# EAGLE design DSP_CNC (EAGLE 9.0.0)
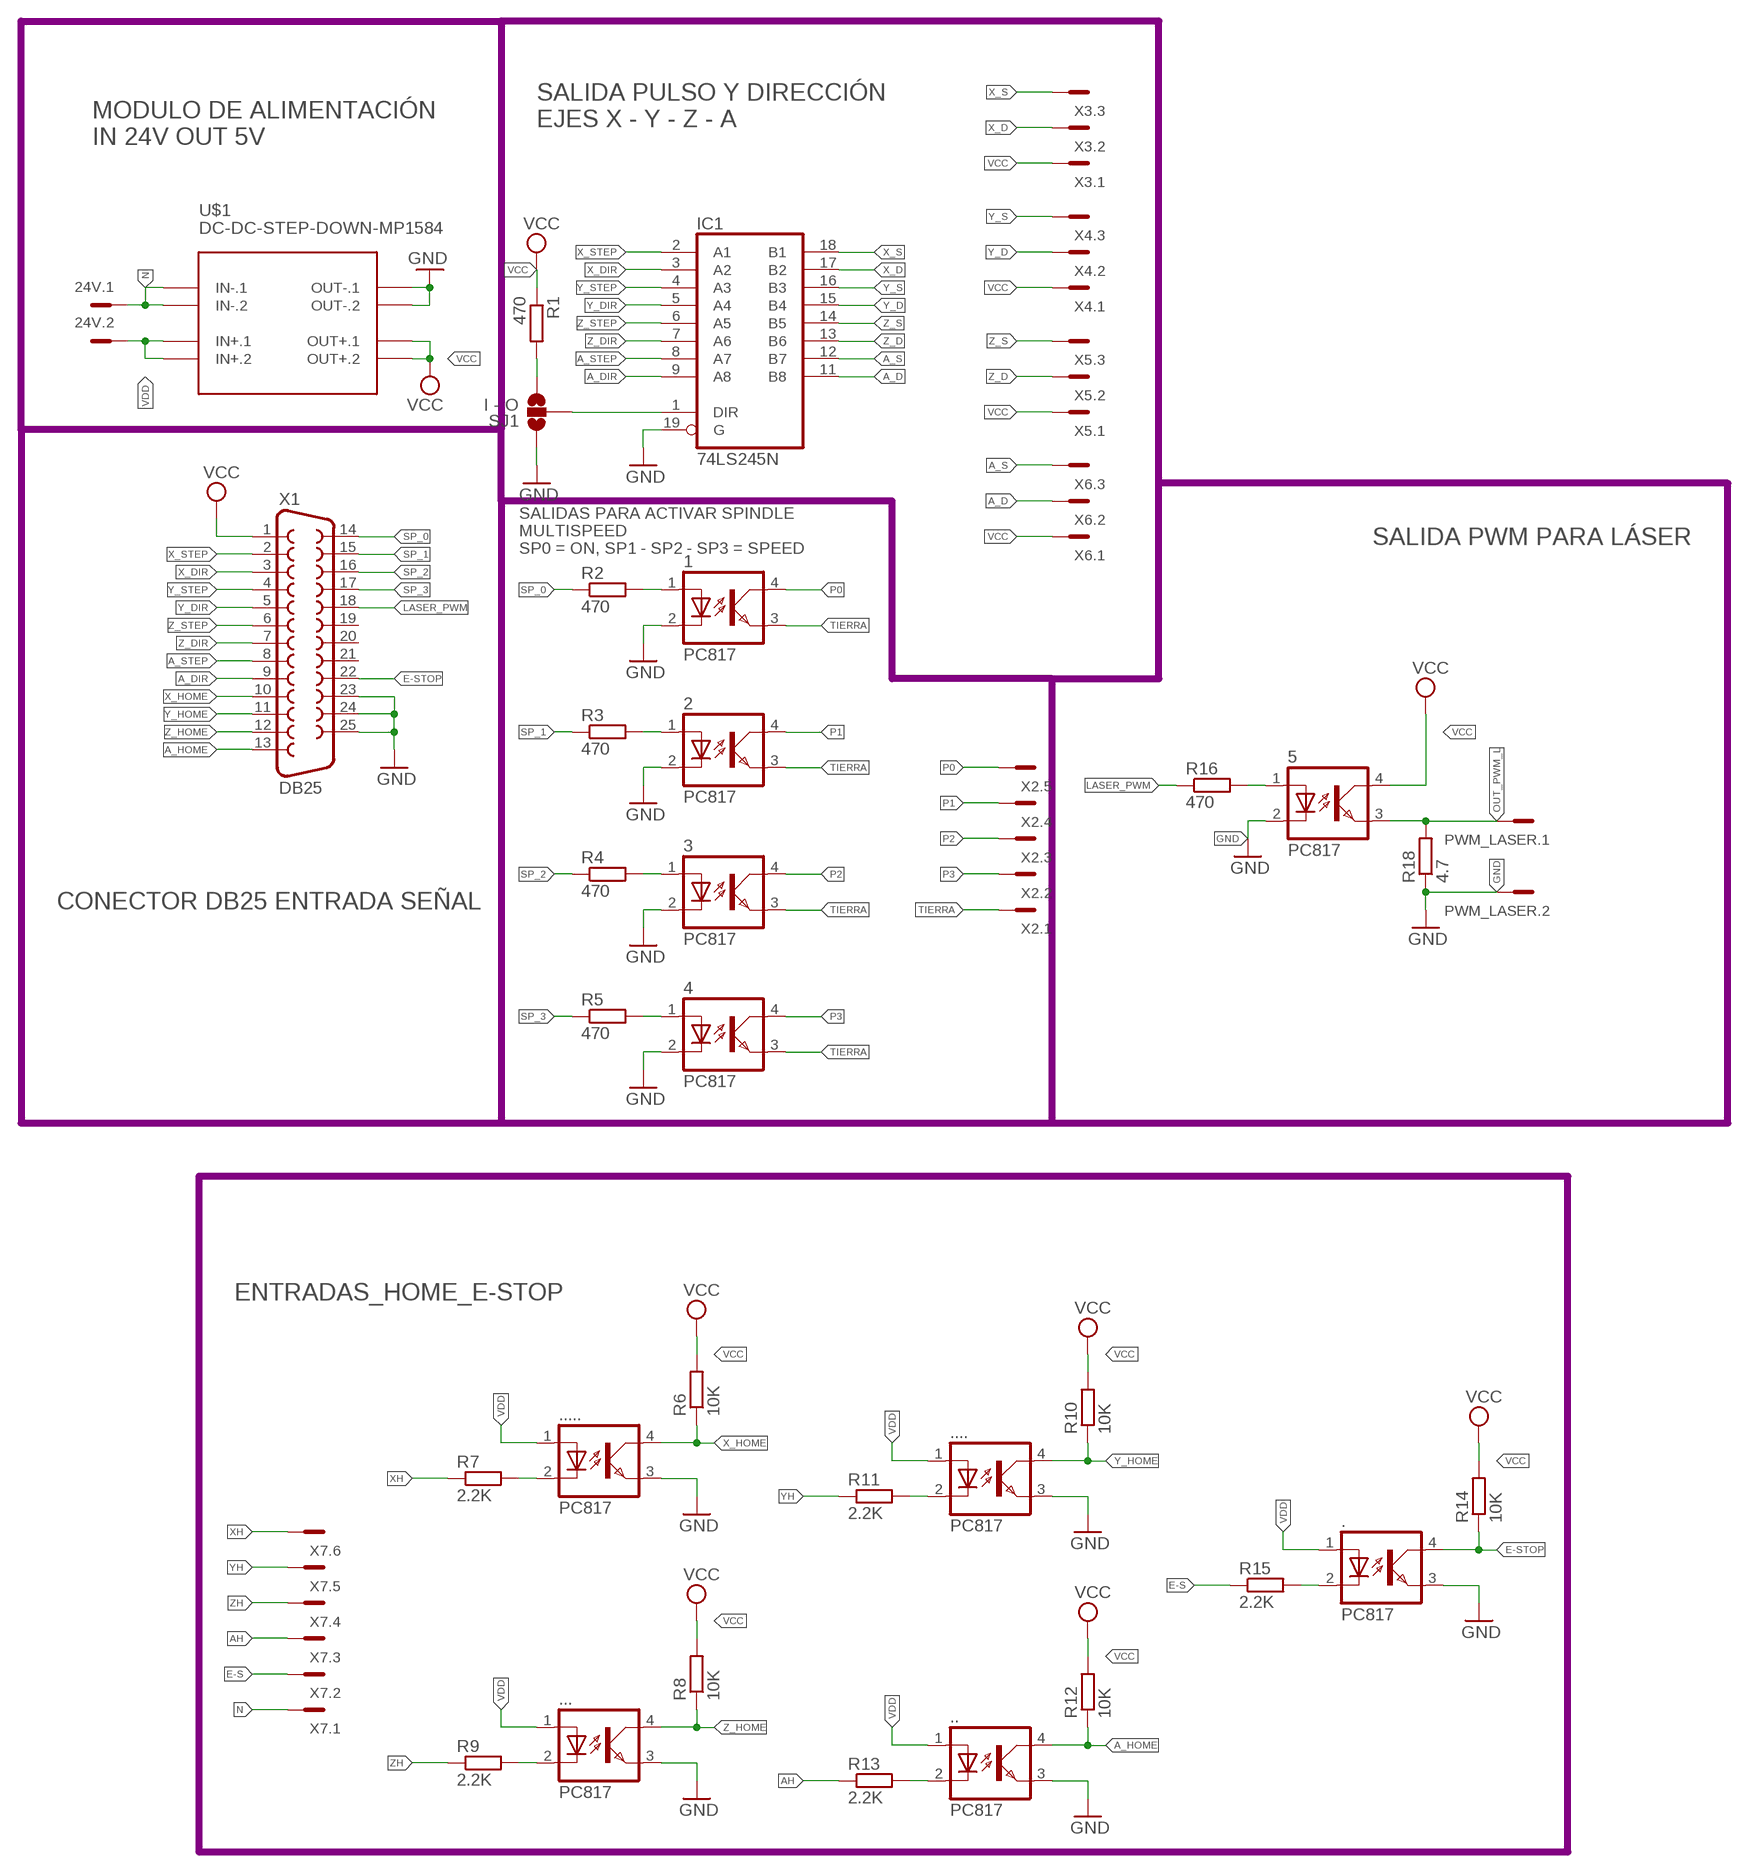
[diagram p0: schematic, sheet 1]

## Parts
1  PC817  [DIL04]
2  PC817  [DIL04]
3  PC817  [DIL04]
4  PC817  [DIL04]
5  PC817  [DIL04]
24V  MCV2  [MCV2]
.  PC817  [DIL04]
..  PC817  [DIL04]
...  PC817  [DIL04]
....  PC817  [DIL04]
.....  PC817  [DIL04]
IC1  74LS245N  [DIL20]
PWM_LASER  MCV2  [MCV2]
R1  470  R-EU_0207/10  [0207/10]
R2  470  R-EU_0207/10  [0207/10]
R3  470  R-EU_0207/10  [0207/10]
R4  470  R-EU_0207/10  [0207/10]
R5  470  R-EU_0207/10  [0207/10]
R6  10K  R-EU_0207/10  [0207/10]
R7  2.2K  R-EU_0207/10  [0207/10]
R8  10K  R-EU_0207/10  [0207/10]
R9  2.2K  R-EU_0207/10  [0207/10]
R10  10K  R-EU_0207/10  [0207/10]
R11  2.2K  R-EU_0207/10  [0207/10]
R12  10K  R-EU_0207/10  [0207/10]
R13  2.2K  R-EU_0207/10  [0207/10]
R14  10K  R-EU_0207/10  [0207/10]
R15  2.2K  R-EU_0207/10  [0207/10]
R16  470  R-EU_0207/10  [0207/10]
R18  4.7  R-EU_0207/10  [0207/10]
SJ1  I - O  SOLDERJUMPER_2WAY-OLDW  [SJ_2W]
U$1  DC-DC-STEP-DOWN-MP1584  [DC-DC-STEP-DOWN-MP1584]
X1  DB25  F25HP  [F25HP]
X2  SPINDLE ON - SP123  MCV5  [MCV5]
X3  EJE_X  MCV3  [MCV3]
X4  EJE_Y  MCV3  [MCV3]
X5  EJE_Z  MCV3  [MCV3]
X6  EJE_A  MCV3  [MCV3]
X7  INPUT_HOME_E-STOP  MCV6  [MCV6]

## Nets
A_D: IC1.11(B8) X6.2
A_DIR: IC1.9(A8) X1.9
A_HOME: ...4(COL) R12.1 X1.13
A_S: IC1.12(B7) X6.3
A_STEP: IC1.8(A7) X1.8
AH: R13.1 X7.3
E-S: R15.1 X7.2
E-STOP: ..4(COL) R14.1 X1.22
GND: 1.2(C) 2.2(C) 3.2(C) 4.2(C) 5.2(C) ..3(EMIT) ...3(EMIT) ....3(EMIT) .....3(EMIT) ......3(EMIT) IC1.19(G) PWM_LASER.2 R18.1 SJ1.1 U$1.OUT-.1 U$1.OUT-.2 X1.23 X1.24 X1.25
LASER_PWM: R16.1 X1.18
N: 24V.1 U$1.IN-.1 U$1.IN-.2 X7.1
N$1: 5.1(A) R16.2
N$3: R1.2 SJ1.3
N$4: IC1.1(DIR) SJ1.2
N$5: 2.1(A) R3.2
N$6: 1.1(A) R2.2
N$7: 3.1(A) R4.2
N$8: 4.1(A) R5.2
N$9: ......2(C) R7.2
N$10: ....2(C) R9.2
N$11: .....2(C) R11.2
N$12: ...2(C) R13.2
N$13: ..2(C) R15.2
OUT_PWM_L: 5.3(EMIT) PWM_LASER.1 R18.2
P0: 1.4(COL) X2.5
P1: 2.4(COL) X2.4
P2: 3.4(COL) X2.3
P3: 4.4(COL) X2.2
SP_0: R2.1 X1.14
SP_1: R3.1 X1.15
SP_2: R4.1 X1.16
SP_3: R5.1 X1.17
TIERRA: 1.3(EMIT) 2.3(EMIT) 3.3(EMIT) 4.3(EMIT) X2.1
VCC: 5.4(COL) R1.1 R6.2 R8.2 R10.2 R12.2 R14.2 U$1.OUT+.1 U$1.OUT+.2 X1.1 X3.1 X4.1 X5.1 X6.1
VDD: 24V.2 ..1(A) ...1(A) ....1(A) .....1(A) ......1(A) U$1.IN+.1 U$1.IN+.2
X_D: IC1.17(B2) X3.2
X_DIR: IC1.3(A2) X1.3
X_HOME: ......4(COL) R6.1 X1.10
X_S: IC1.18(B1) X3.3
X_STEP: IC1.2(A1) X1.2
XH: R7.1 X7.6
Y_D: IC1.15(B4) X4.2
Y_DIR: IC1.5(A4) X1.5
Y_HOME: .....4(COL) R10.1 X1.11
Y_S: IC1.16(B3) X4.3
Y_STEP: IC1.4(A3) X1.4
YH: R11.1 X7.5
Z_D: IC1.13(B6) X5.2
Z_DIR: IC1.7(A6) X1.7
Z_HOME: ....4(COL) R8.1 X1.12
Z_S: IC1.14(B5) X5.3
Z_STEP: IC1.6(A5) X1.6
ZH: R9.1 X7.4
Unconnected: X1.19 X1.20 X1.21

## Notes on the sheet
- SALIDA PULSO Y DIRECCIÓN
  EJES X - Y - Z - A
- MODULO DE ALIMENTACIÓN
  IN 24V OUT 5V
- SALIDAS PARA ACTIVAR SPINDLE
  MULTISPEED 
  SP0 = ON, SP1 - SP2 - SP3 = SPEED
- SALIDA PWM PARA LÁSER
- CONECTOR DB25 ENTRADA SEÑAL
- ENTRADAS_HOME_E-STOP

## Power pins joined to a net without a drawn wire
GND: IC1.10(GND)
VCC: IC1.20(VCC)

## Library data of the parts
1-5 . .. ... .... ..... = stepper_drivers_etc:PC817*: SHARP OPTO COUPLER
24V PWM_LASER = con-phoenix_3.81_mcv:MCV2: Mini-Combicon 3.81mm vertikal 2polig (ohne Gegenstecker)
IC1 = 74xx-us:74*245: Octal BUS TRANSCEIVER, 3-state
R1-R16 R18 = resistor:R-EU_: RESISTOR, European symbol
SJ1 = SparkFun:SOLDERJUMPER_2WAY-OLD: Solder Jumper 2 way solder jumper
U$1 = diy-modules:DC-DC-STEP-DOWN-MP1584: DC/DC Step-Down Regulator based on MP1584 chip MP1584 datasheet available here: http://www.haoyuelectronics.com/Attachment/MP1584/MP1584.pdf Click here to find device on ebay.com <http://www.ebay.com/sch/mp1584+module>
X1 = SparkFun:F25: D-SUB 25 25 Pin male connector. PCB edge mount for regular PCB thicknesses. This connector will connect directly to the back of a PC parallel port or through a normal DB25 extension cable (M/F). SKU: PRT-08287
X2 = con-phoenix_3.81_mcv:MCV5: Mini-Combicon 3.81mm vertikal 5polig (ohne Gegenstecker)
X3-X6 = con-phoenix_3.81_mcv:MCV3: Mini-Combicon 3.81mm vertikal 3polig (ohne Gegenstecker)
X7 = con-phoenix_3.81_mcv:MCV6: Mini-Combicon 3.81mm vertikal 6polig (ohne Gegenstecker)

## Board
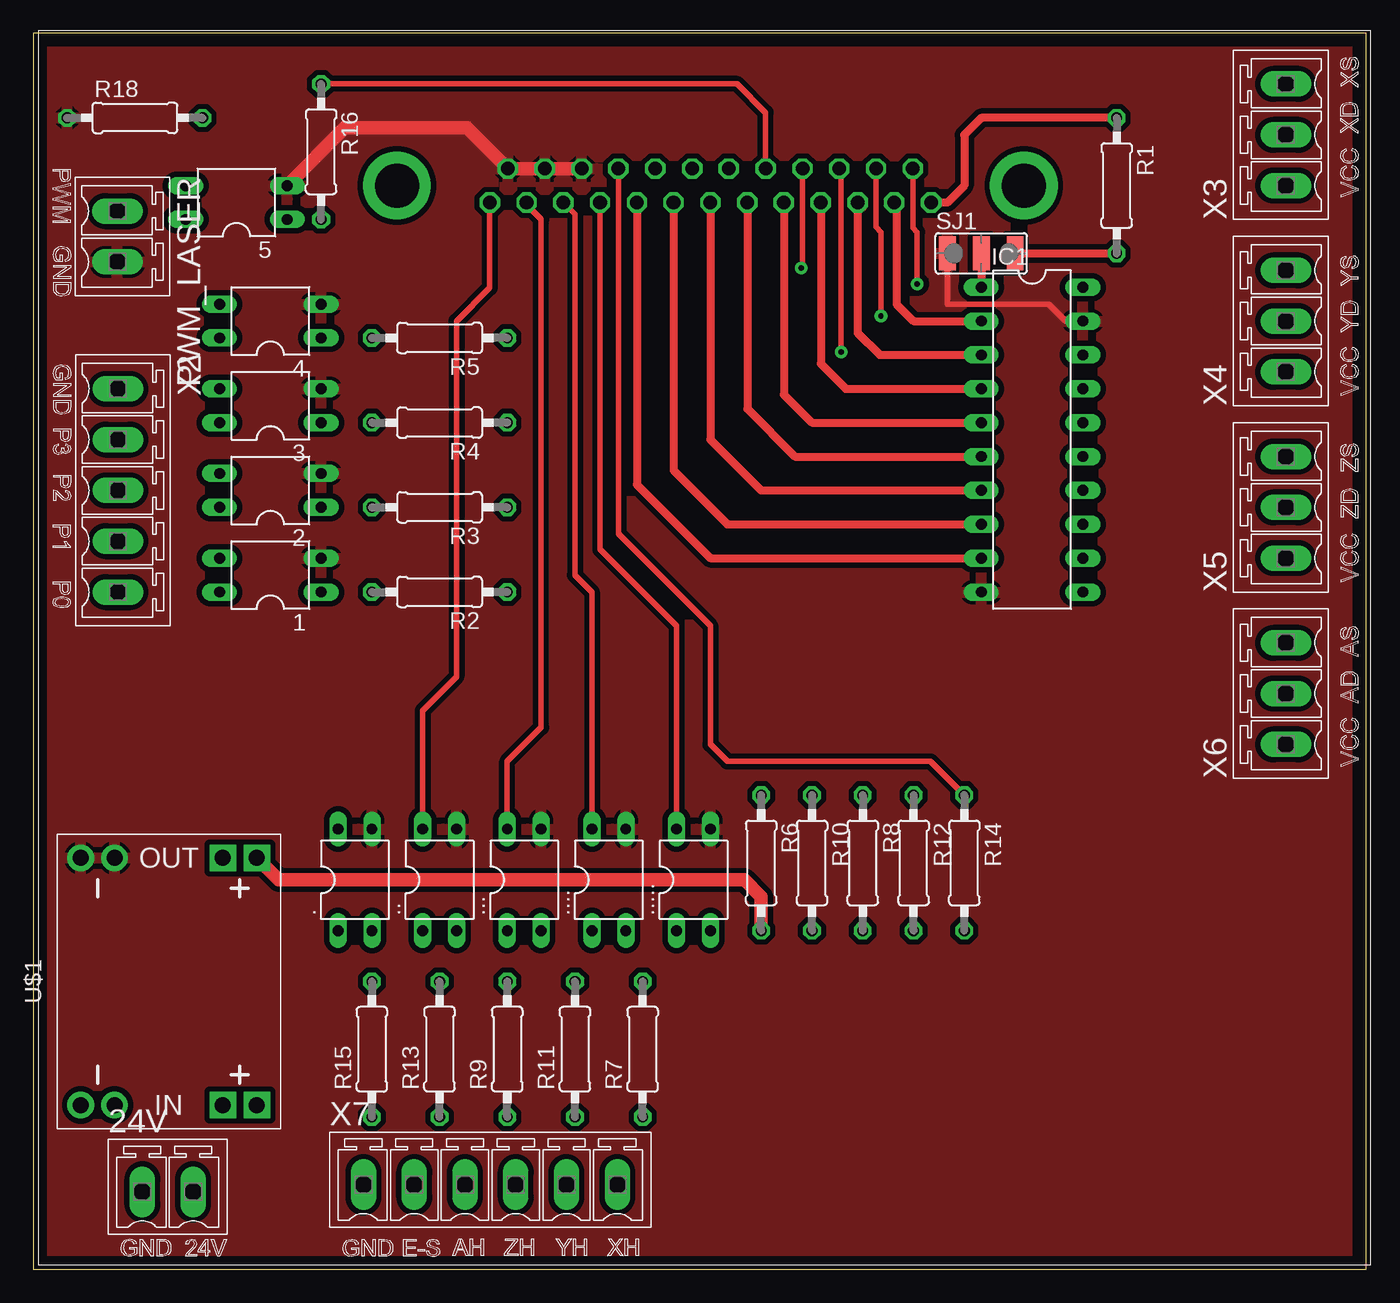
[diagram p1: board, top side]
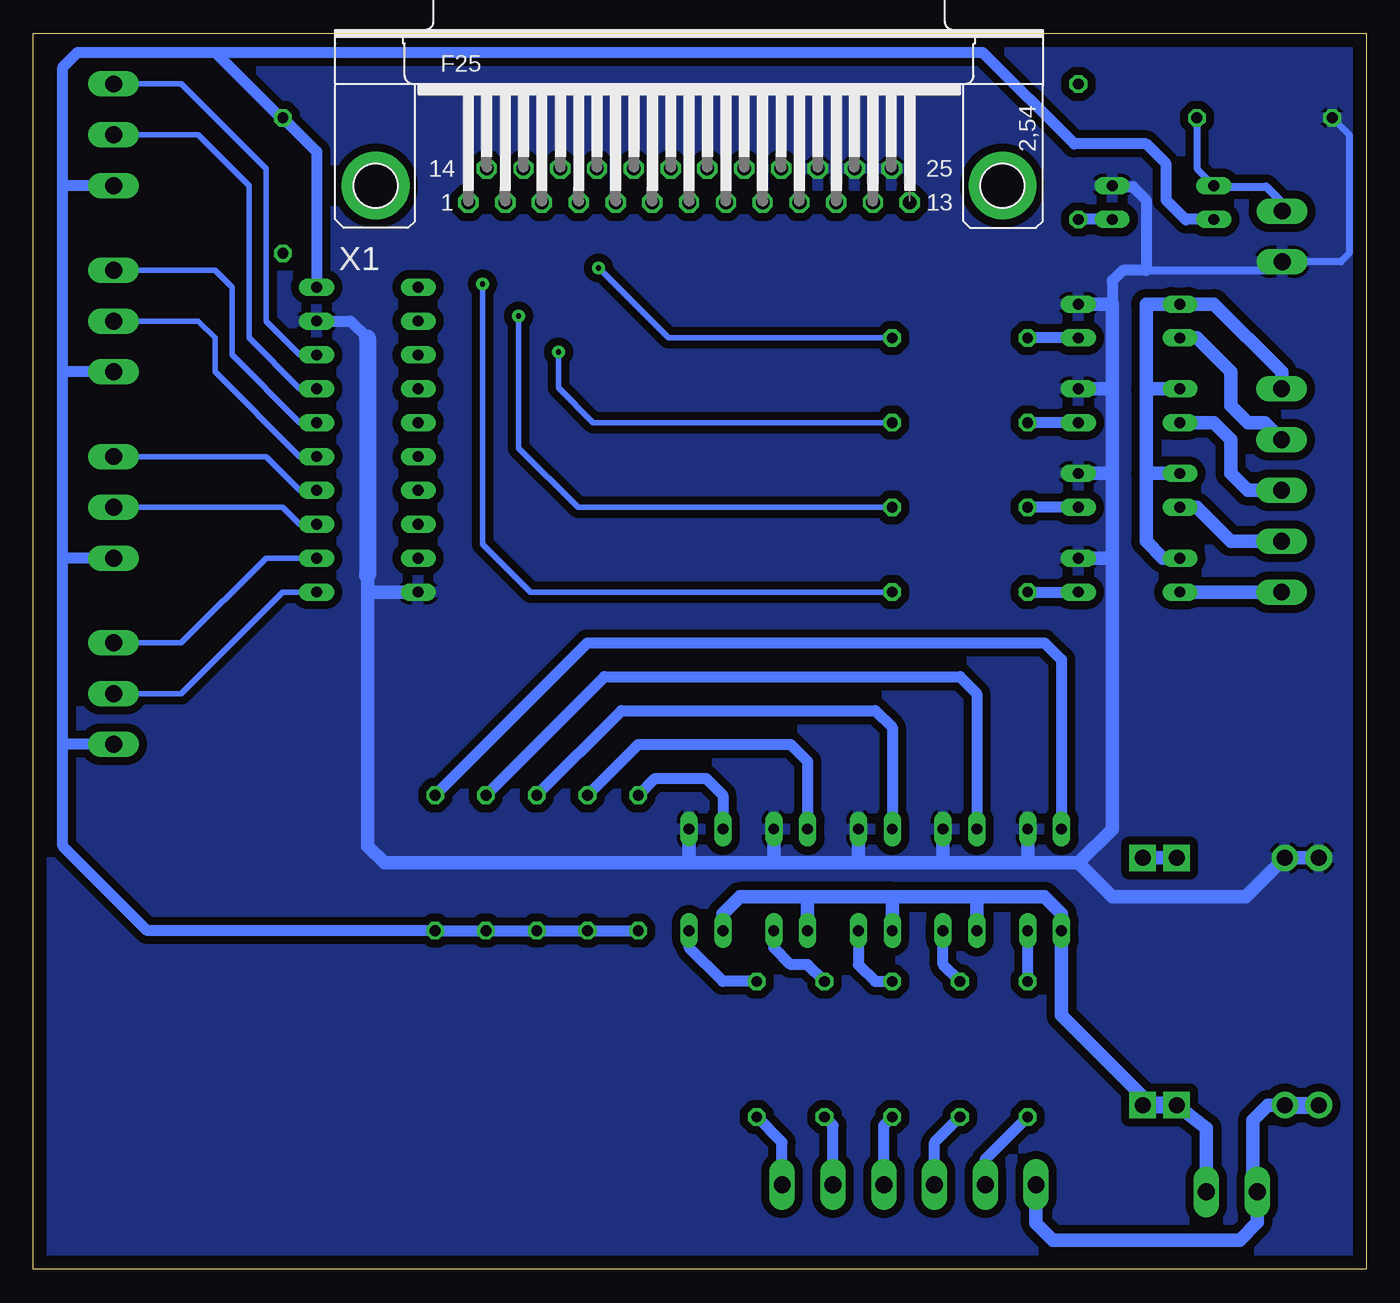
[diagram p2: board, bottom side, seen from below]

Size 100 x 92.7 mm. Coordinates in mm from the lower left corner, seen from the top.
Outline: 0,0 100,0 100,92.7 0,92.7 0,0
Copper layers (1*16): Top 0.035mm / dielectric 1.5mm / Bottom 0.035mm
Design rules "default": minimum track width 6mil, minimum drill 0.35mm, track to track 6mil, track to pad 6mil, pad to pad 6mil, via to via 6mil, smd to smd 6mil, copper to edge 40mil, drill to drill 6mil, minimum pad ring 10mil, minimum via ring 8mil, stop-mask expansion 4mil, vias tented up to drill 0mil, thermal gap 10mil

### Footprints (pad centres in the part's own frame; a part is rotated, then mirrored left to right if it is on the bottom)
DIL04 = drill 0.813 long: 1 -1.27,-3.81; 2 1.27,-3.81; 3 1.27,3.81; 4 -1.27,3.81
MCV2 = drill 1.27 pad 1.905 long: 1 -1.905,0; 2 1.905,0
DIL20 = drill 0.813 long: 1 -11.43,-3.81; 2 -8.89,-3.81; 3 -6.35,-3.81; 4 -3.81,-3.81; 5 -1.27,-3.81; 6 1.27,-3.81; 7 3.81,-3.81; 8 6.35,-3.81; 9 8.89,-3.81; 10 11.43,-3.81; 11 11.43,3.81; 12 8.89,3.81; 13 6.35,3.81; 14 3.81,3.81; 15 1.27,3.81; 16 -1.27,3.81; 17 -3.81,3.81; 18 -6.35,3.81; 19 -8.89,3.81; 20 -11.43,3.81
0207/10 = drill 0.813 octagon: 1 -5.08,0; 2 5.08,0
SJ_2W = smd 1.27 x 2.54: 1 -2.54,0; 2 0,0; 3 2.54,0
DC-DC-STEP-DOWN-MP1584 = drill 1.2 pad 2 square: IN+.1 -9.271,-4.064; IN+.2 -9.271,-6.604; OUT+.1 9.271,-4.064; OUT+.2 9.271,-6.604 | drill 1.2 pad 2: IN-.1 -9.271,6.604; IN-.2 -9.271,4.064; OUT-.1 9.271,6.604; OUT-.2 9.271,4.064
F25HP = drill 1.016 octagon: 1 -16.561,-1.27; 2 -13.792,-1.27; 3 -11.049,-1.27; 4 -8.28,-1.27; 5 -5.512,-1.27; 6 -2.769,-1.27; 7 0,-1.27; 8 2.769,-1.27; 9 5.512,-1.27; 10 8.28,-1.27; 11 11.049,-1.27; 12 13.792,-1.27; 13 16.561,-1.27; 14 -15.189,1.27; 15 -12.421,1.27; 16 -9.652,1.27; 17 -6.909,1.27; 18 -4.14,1.27; 19 -1.372,1.27; 20 1.372,1.27; 21 4.14,1.27; 22 6.909,1.27; 23 9.652,1.27; 24 12.421,1.27; 25 15.189,1.27 | drill 3.302 pad 5.08: G1 -23.52,0; G2 23.52,0
MCV5 = drill 1.27 pad 1.905 long: 1 -7.62,0; 2 -3.81,0; 3 0,0; 4 3.81,0; 5 7.62,0
MCV3 = drill 1.27 pad 1.905 long: 1 -3.81,0; 2 0,0; 3 3.81,0
MCV6 = drill 1.27 pad 1.905 long: 1 -9.525,0; 2 -5.715,0; 3 -1.905,0; 4 1.905,0; 5 5.715,0; 6 9.525,0

### Placement (x,y rotation side)
1  17.78,52.07 90 top
2  17.78,58.42 90 top
3  17.78,64.77 90 top
4  17.78,71.12 90 top
5  15.24,80.01 90 top
24V  10.08,5.81 0 top
.  24.13,29.21 0 top
..  30.48,29.21 0 top
...  36.83,29.21 0 top
....  43.18,29.21 0 top
.....  49.53,29.21 0 top
IC1  74.93,62.23 270 top
PWM_LASER  6.31,77.47 270 top
R1  81.28,81.28 270 top
R2  30.48,50.8 180 top
R3  30.48,57.15 180 top
R4  30.48,63.5 180 top
R5  30.48,69.85 180 top
R6  54.61,30.48 270 top
R7  45.72,16.51 90 top
R8  62.23,30.48 270 top
R9  35.56,16.51 90 top
R10  58.42,30.48 270 top
R11  40.64,16.51 90 top
R12  66.04,30.48 270 top
R13  30.48,16.51 90 top
R14  69.85,30.48 270 top
R15  25.4,16.51 90 top
R16  21.59,83.82 270 top
R18  7.62,86.36 0 top
SJ1  71.12,76.2 0 top
U$1  10.16,21.59 90 top
X1  50.8,81.28 0 bottom
X2  6.35,58.42 270 top
X3  93.98,85.09 90 top
X4  93.98,71.12 90 top
X5  93.98,57.15 90 top
X6  93.98,43.18 90 top
X7  34.29,6.35 0 top

### Tracks (layer width: path | path; a pad name or v marks a point on that pad's centre or on a via)
A_D
  Bottom 0.406: X6.2 88.9,43.18 81.28,50.8 IC1.11
A_DIR
  Top 0.61: X1.9 45.29,58.85 50.8,53.34 IC1.9
A_HOME
  Top 0.406: X1.13 34.24,73.61 31.75,71.12 31.75,44.45 29.21,41.91 ...4
  Bottom 0.813: R12.1 57.15,44.45 30.48,44.45 29.21,43.18 ...4
A_S
  Bottom 0.406: X6.3 88.9,46.99 82.55,53.34 IC1.12
A_STEP
  Top 0.61: X1.8 48.03,59.92 52.07,55.88 IC1.8
AH
  Bottom 0.813: X7.3 32.38,9.52 R13.1
E-S
  Bottom 0.813: X7.2 28.57,8.25 R15.1
E-STOP
  Top 0.406: X1.22 43.89,55.17 50.8,48.26 50.8,39.37 52.07,38.1 67.31,38.1 R14.1
  Bottom 0.813: R14.1 58.42,46.99 24.13,46.99 22.86,45.72 ..4
GND
  Top 0.406: SJ1.1 68.58,72.39 76.2,72.39 77.47,71.12 IC1.19
  Top 1.016: X1.23 X1.24 X1.25 32.56,85.6 23.37,85.6 5.2
  Bottom 0.508: R18.1 1.27,85.09 1.27,76.2 1.91,75.56 PWM_LASER.2
  Bottom 0.61: 16.5,74.93 6.95,74.93 PWM_LASER.2
  Bottom 0.813: IC1.19 76.2,71.12 74.93,69.85 | 19.05,72.39 19.05,74.15 18.27,74.93 16.5,74.93 16.5,80.2 17.5,81.2 18.97,81.2 5.2
  Bottom 1.016: 31.75,30.48 25.4,30.48 | 25.4,30.48 ..3 | 31.75,30.48 ...3 | U$1.OUT-.1 U$1.OUT-.2 9.02,27.94 19.05,27.94 21.59,30.48 | 21.59,30.48 25.4,30.48 | 31.75,30.48 38.1,30.48 | 38.1,30.48 44.45,30.48 | 44.45,30.48 50.8,30.48 | 50.8,30.48 ......3 | .....3 44.45,30.48 | ....3 38.1,30.48 | 19.05,59.69 19.05,66.04 | 19.05,66.04 19.05,72.39 4.2 | 3.2 19.05,66.04 | 2.2 19.05,59.69 | 19.05,53.34 19.05,59.69 | 1.2 19.05,53.34 | 50.8,30.48 73.66,30.48 74.93,31.75 74.93,50.8 | 74.93,50.8 74.93,52.07 | 74.93,50.8 IC1.10 | 19.05,53.34 19.05,33.02 21.59,30.48
  Bottom 1.27: 74.93,69.85 74.93,52.07
  pour Bottom (isolate 0.61): -1.5,93.7 101,93.7 101,-1.8 -1.5,-1.8
  pour Top (isolate 0.4): -2,94.2 101.5,94.2 101.5,-1.3 -2,-1.3
LASER_PWM
  Top 0.406: X1.18 54.94,86.76 52.8,88.9 R16.1
N
  Bottom 1.016: U$1.IN-.2 7.38,12.32 8.5,11.2 8.5,6.13 24V.1 8.18,3.53 9.5,2.2 23.5,2.2 24.77,3.47 X7.1
  Bottom 1.27: U$1.IN-.2 U$1.IN-.1
N$1
  Bottom 0.813: 5.1 R16.2
N$3
  Top 0.61: SJ1.3 R1.2
N$4
  Top 0.61: SJ1.2 IC1.1
N$5
  Bottom 0.813: 2.1 R3.2
N$6
  Bottom 0.813: R2.2 1.1
N$7
  Bottom 0.813: 3.1 R4.2
N$8
  Bottom 0.813: 4.1 R5.2
N$9
  Bottom 0.813: R7.2 48.26,21.59 50.8,24.13 ......2
N$10
  Bottom 0.813: ....2 38.1,22.86 36.83,21.59 R9.2
N$11
  Bottom 0.813: R11.2 41.91,22.86 43.18,22.86 44.45,24.13 .....2
N$12
  Bottom 0.813: R13.2 31.75,22.86 ...2
N$13
  Bottom 0.813: R15.2 ..2
OUT_PWM_L
  Bottom 0.508: R18.2 12.7,82.55 5.3
  Bottom 0.61: 5.3 11.35,81.2 7.5,81.2 6.31,80.01 PWM_LASER.1
P0
  Bottom 1.016: X2.5 1.4
P1
  Bottom 1.016: 2.4 12.7,57.15 10.16,54.61 X2.4
P2
  Bottom 1.016: X2.3 8.89,58.42 10.16,59.69 10.16,62.23 11.43,63.5 3.4
P3
  Bottom 1.016: X2.2 7.62,63.5 8.89,63.5 10.16,64.77 10.16,67.31 12.7,69.85 4.4
SP_0  (via drill 0.4 pad 0.95)
  Top 0.406: v66.3,73.9 66.3,77.8 65.99,78.11 X1.14
  Bottom 0.406: R2.1 62.7,50.8 66.3,54.4 v66.3,73.9
SP_1  (via drill 0.4 pad 0.95)
  Top 0.406: v63.6,71.5 63.6,77.8 63.22,78.18 X1.15
  Bottom 0.406: R3.1 59.15,57.15 63.6,61.6 v63.6,71.5
SP_2  (via drill 0.4 pad 0.95)
  Top 0.406: v60.6,68.8 60.6,82.4 X1.16
  Bottom 0.406: R4.1 58,63.5 60.6,66.1 v60.6,68.8
SP_3  (via drill 0.4 pad 0.95)
  Top 0.406: X1.17 57.71,75.21 v57.6,75.1
  Bottom 0.406: v57.6,75.1 52.35,69.85 R5.1
TIERRA
  Bottom 1.016: X2.1 6.35,67.31 11.43,72.39 4.3 16.51,72.39 16.51,66.04 | 16.51,66.04 16.51,59.69 | 16.51,59.69 16.51,54.61 15.24,53.34 1.3 | 2.3 16.51,59.69 | 3.3 16.51,66.04
VCC
  Top 0.61: R1.1 71.12,86.36 69.85,85.09 69.85,81.28 68.58,80.01 X1.1
  Top 1.016: U$1.OUT+.2 18.41,29.21 53.34,29.21 54.61,27.94 R6.2
  Bottom 0.813: 97.79,39.37 97.79,31.75 91.44,25.4 R14.2 R12.2 R8.2 R10.2 R6.2 | 97.79,39.37 97.79,53.34 | 97.79,53.34 97.79,67.31 | 97.79,67.31 97.79,81.28 | 97.79,81.28 97.79,90.17 96.68,91.28 86.36,91.28 | X3.1 97.79,81.28 | X4.1 97.79,67.31 | X5.1 97.79,53.34 | 86.36,91.28 81.44,86.36 R1.1 78.74,83.82 IC1.20 | X6.1 97.79,39.37 | 86.36,91.28 28.78,91.28 21.9,84.4 16.5,84.4 15,82.9 15,80.2 13.5,78.7 13.46,78.74 5.4
  Bottom 1.016: U$1.OUT+.2 U$1.OUT+.1
VDD
  Bottom 1.016: 35.56,27.94 41.91,27.94 | .....1 41.91,27.94 | ....1 35.56,27.94 | 35.56,27.94 29.21,27.94 | 29.21,27.94 24.13,27.94 22.86,26.67 ..1 22.86,19.05 16.76,12.95 U$1.IN+.2 | ...1 29.21,27.94 | 41.91,27.94 46.99,27.94 48.26,26.67 ......1 | U$1.IN+.1 11.98,10.58 24V.2
  Bottom 1.27: U$1.IN+.1 U$1.IN+.2
X_D
  Bottom 0.406: IC1.17 80.01,66.04 83.82,69.85 83.82,81.28 87.63,85.09 X3.2
X_DIR
  Top 0.61: 62.23,79.63 X1.3 61.85,70.23 63.5,68.58 IC1.3
X_HOME
  Top 0.406: X1.10 42.52,54 48.26,48.26 ......4
  Bottom 0.813: R6.1 53.34,36.83 49.53,36.83 48.26,35.56 ......4
X_S
  Bottom 0.406: X3.3 88.9,88.9 82.55,82.55 82.55,71.12 80.01,68.58 IC1.18
X_STEP
  Top 0.61: X1.2 64.77,79.83 64.77,72.39 66.04,71.12 IC1.2
XH
  Bottom 0.813: X7.6 43.81,9.52 R7.1
Y_D
  Bottom 0.406: X4.2 87.63,71.12 86.36,69.85 86.36,67.31 80.01,60.96 IC1.15
Y_DIR
  Top 0.61: X1.5 56.31,65.61 58.42,63.5 IC1.5
Y_HOME
  Top 0.406: X1.11 40.64,79.12 40.64,52.07 41.91,50.8 .....4
  Bottom 0.813: .....4 41.91,38.1 43.18,39.37 54.61,39.37 R10.1
Y_S
  Bottom 0.406: X4.3 86.36,74.93 85.09,73.66 85.09,68.58 80.01,63.5 IC1.16
Y_STEP
  Top 0.61: X1.4 59.08,67.92 60.96,66.04 IC1.4
YH
  Bottom 0.813: X7.5 40.01,10.79 R11.1
Z_D
  Bottom 0.406: X5.2 81.28,57.15 80.01,55.88 IC1.13
Z_DIR
  Top 0.61: X1.7 50.8,62.23 54.61,58.42 IC1.7
Z_HOME
  Top 0.406: X1.12 37.01,79.83 38.1,78.74 38.1,40.64 35.56,38.1 ....4
  Bottom 0.813: R8.1 55.88,41.91 36.83,41.91 35.56,40.64 ....4
Z_S
  Bottom 0.406: X5.3 82.55,60.96 80.01,58.42 IC1.14
Z_STEP
  Top 0.61: X1.6 53.57,64.54 57.15,60.96 IC1.6
ZH
  Bottom 0.813: X7.4 36.2,10.79 R9.1